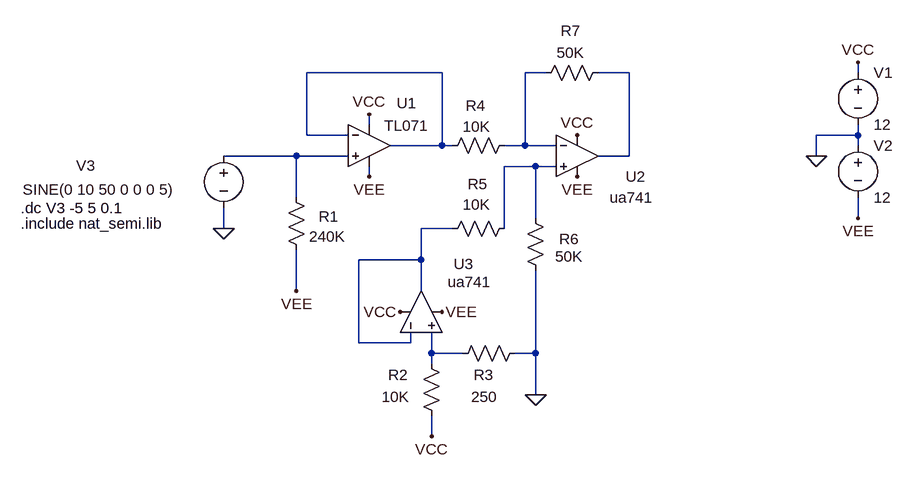
[diagram p0: schematic AnalogTask.asc]
AnalogTask.asc, the LTspice schematic file:
Version 4
SHEET 1 936 700
WIRE 240 48 32 48
WIRE 400 48 368 48
WIRE 528 48 480 48
WIRE 880 48 880 32
WIRE 128 128 128 112
WIRE 32 144 32 48
WIRE 96 144 32 144
WIRE 880 144 880 128
WIRE 880 144 816 144
WIRE 240 160 240 48
WIRE 240 160 160 160
WIRE 256 160 240 160
WIRE 368 160 368 48
WIRE 368 160 336 160
WIRE 416 160 368 160
WIRE 880 160 880 144
WIRE 16 176 -96 176
WIRE 96 176 16 176
WIRE 528 176 528 48
WIRE 528 176 480 176
WIRE 816 176 816 144
WIRE 384 192 336 192
WIRE 416 192 384 192
WIRE 128 208 128 192
WIRE 16 240 16 176
WIRE 384 272 384 192
WIRE 880 272 880 240
WIRE -96 288 -96 256
WIRE 256 288 208 288
WIRE 336 288 336 192
WIRE 208 336 208 288
WIRE 208 336 112 336
WIRE 16 384 16 320
WIRE 208 384 208 336
WIRE 112 464 112 336
WIRE 192 464 192 448
WIRE 192 464 112 464
WIRE 224 480 224 448
WIRE 272 480 224 480
WIRE 384 480 384 352
WIRE 384 480 352 480
WIRE 224 496 224 480
WIRE 384 544 384 480
WIRE 224 608 224 576
FLAG 880 32 VCC
FLAG 880 272 VEE
FLAG 816 176 0
FLAG 128 112 VCC
FLAG 128 208 VEE
FLAG -96 288 0
FLAG 16 384 VEE
FLAG 448 144 VCC
FLAG 448 208 VEE
FLAG 176 416 VCC
FLAG 240 416 VEE
FLAG 224 608 VCC
FLAG 384 544 0
SYMBOL Opamps\\opamp2 128 96 R0
WINDOW 0 42 -1 Left 2
WINDOW 3 23 33 Left 2
SYMATTR InstName U1
SYMATTR Value TL071
SYMBOL voltage 880 32 R0
SYMATTR InstName V1
SYMATTR Value 12
SYMBOL voltage 880 144 R0
SYMATTR InstName V2
SYMATTR Value 12
SYMBOL voltage -96 160 R0
WINDOW 3 -309 68 Left 2
WINDOW 123 0 0 Left 2
WINDOW 39 0 0 Left 2
WINDOW 0 -227 31 Left 2
SYMATTR Value SINE(0 10 50 0 0 0 5)
SYMATTR InstName V3
SYMBOL Opamps\\opamp2 448 112 R0
WINDOW 0 75 96 Left 2
WINDOW 3 50 128 Left 2
SYMATTR InstName U2
SYMATTR Value ua741
SYMBOL Opamps\\opamp2 144 416 R270
WINDOW 0 74 114 VRight 2
WINDOW 3 46 105 VRight 2
SYMATTR InstName U3
SYMATTR Value ua741
SYMBOL res 0 224 R0
WINDOW 0 50 45 Left 2
SYMATTR InstName R1
SYMATTR Value 240K
SYMBOL res 208 480 R0
WINDOW 0 -51 33 Left 2
WINDOW 3 -61 67 Left 2
SYMATTR InstName R2
SYMATTR Value 10K
SYMBOL res 368 464 R90
WINDOW 0 65 64 VBottom 2
WINDOW 3 67 63 VTop 2
SYMATTR InstName R3
SYMATTR Value 250
SYMBOL res 352 144 R90
WINDOW 0 -30 60 VBottom 2
WINDOW 3 -29 59 VTop 2
SYMATTR InstName R4
SYMATTR Value 10K
SYMBOL res 352 272 R90
WINDOW 0 -37 57 VBottom 2
WINDOW 3 -37 59 VTop 2
SYMATTR InstName R5
SYMATTR Value 10K
SYMBOL res 368 256 R0
WINDOW 0 52 48 Left 2
WINDOW 3 46 75 Left 2
SYMATTR InstName R6
SYMATTR Value 50K
SYMBOL res 496 32 R90
WINDOW 0 -33 58 VBottom 2
WINDOW 3 -31 58 VTop 2
SYMATTR InstName R7
SYMATTR Value 50K
TEXT -408 280 Left 2 !.include nat_semi.lib
TEXT -408 256 Left 2 !.dc V3 -5 5 0.1

The netlist it stands for:
* AnalogTask.asc
XU1 N004 N001 VCC VEE N001 TL071  ; pins In+ In- V+ V- OUT
V1 VCC 0 12
V2 0 VEE 12
V3 N004 0 SINE(0 10 50 0 0 0 5)
XU2 N005 N002 VCC VEE N003 ua741  ; pins In+ In- V+ V- OUT
XU3 N007 N006 VCC VEE N006 ua741  ; pins In+ In- V+ V- OUT
R1 N004 VEE 240K
R2 N007 VCC 10K
R3 0 N007 250
R4 N002 N001 10K
R5 N005 N006 10K
R6 N005 0 50K
R7 N003 N002 50K
.include nat_semi.lib
.dc V3 -5 5 0.1
.backanno
.end